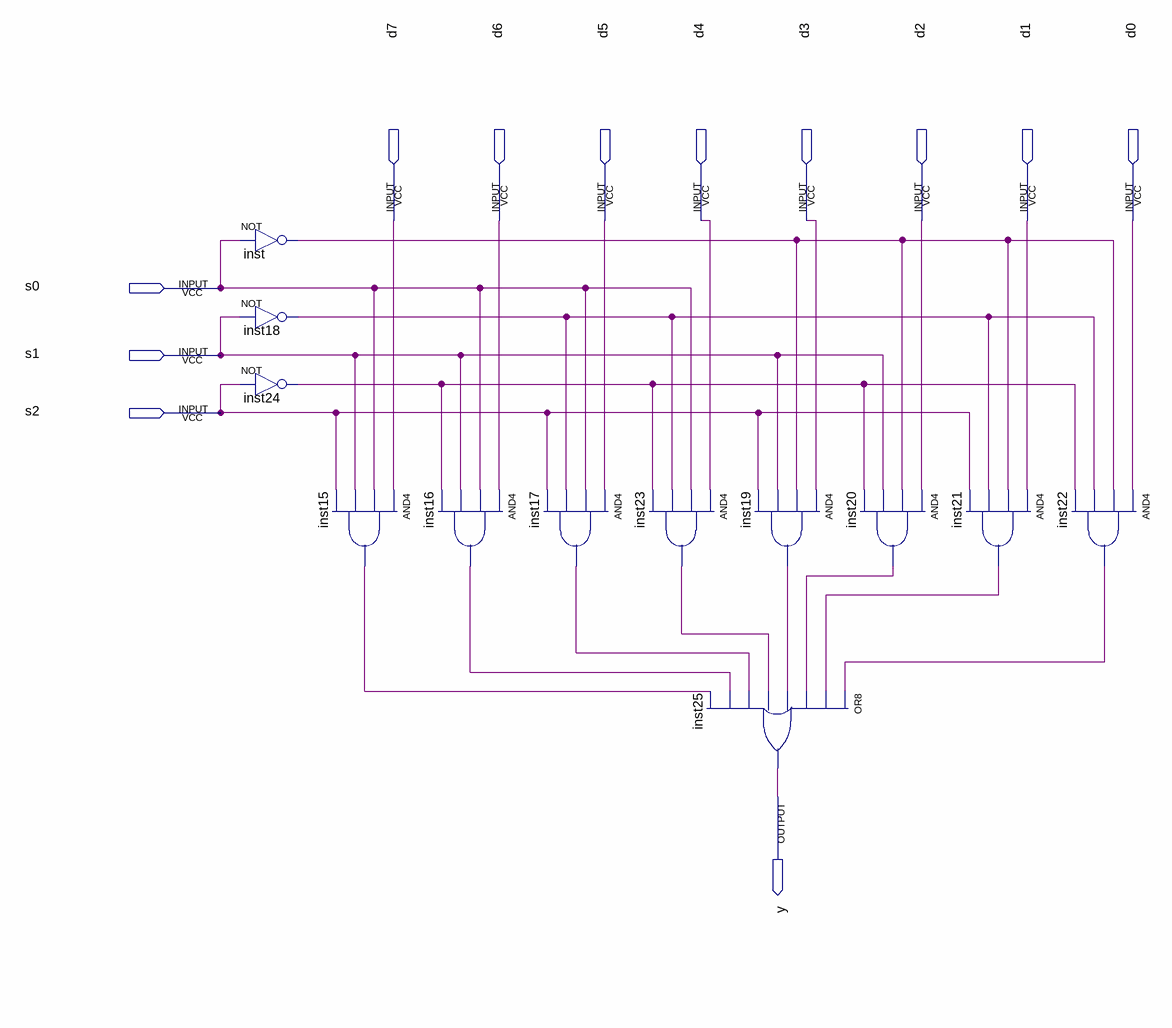
[diagram p0: schematic sheet]
// Quartus schematic zadania_2.bdf as structural Verilog: 12 symbols, 12 pins
module zadania_2 (
  input  d7,
  input  d6,
  input  d5,
  input  d4,
  input  d3,
  input  d2,
  input  d1,
  input  d0,
  input  s0,
  input  s1,
  input  s2,
  output y
);

  wire inst15_out, inst16_out, inst17_out, inst18_out, inst19_out, inst20_out, inst21_out, inst22_out,
       inst23_out, inst24_out, inst_out;

  not inst (inst_out, s0);
  not inst18 (inst18_out, s1);
  not inst24 (inst24_out, s2);
  and inst15 (inst15_out, d7, s0, s1, s2);
  and inst16 (inst16_out, d6, s0, s1, inst24_out);
  and inst17 (inst17_out, d5, s0, inst18_out, s2);
  and inst23 (inst23_out, d4, s0, inst18_out, inst24_out);
  or inst25 (y, inst22_out, inst21_out, inst20_out, inst19_out, inst23_out, inst17_out, inst16_out, inst15_out);
  and inst19 (inst19_out, d3, inst_out, s1, s2);
  and inst20 (inst20_out, d2, inst_out, s1, inst24_out);
  and inst21 (inst21_out, d1, inst_out, inst18_out, s2);
  and inst22 (inst22_out, d0, inst_out, inst18_out, inst24_out);
endmodule
